# Altium project IVT_33_Shokiri_2B.PrjPcb
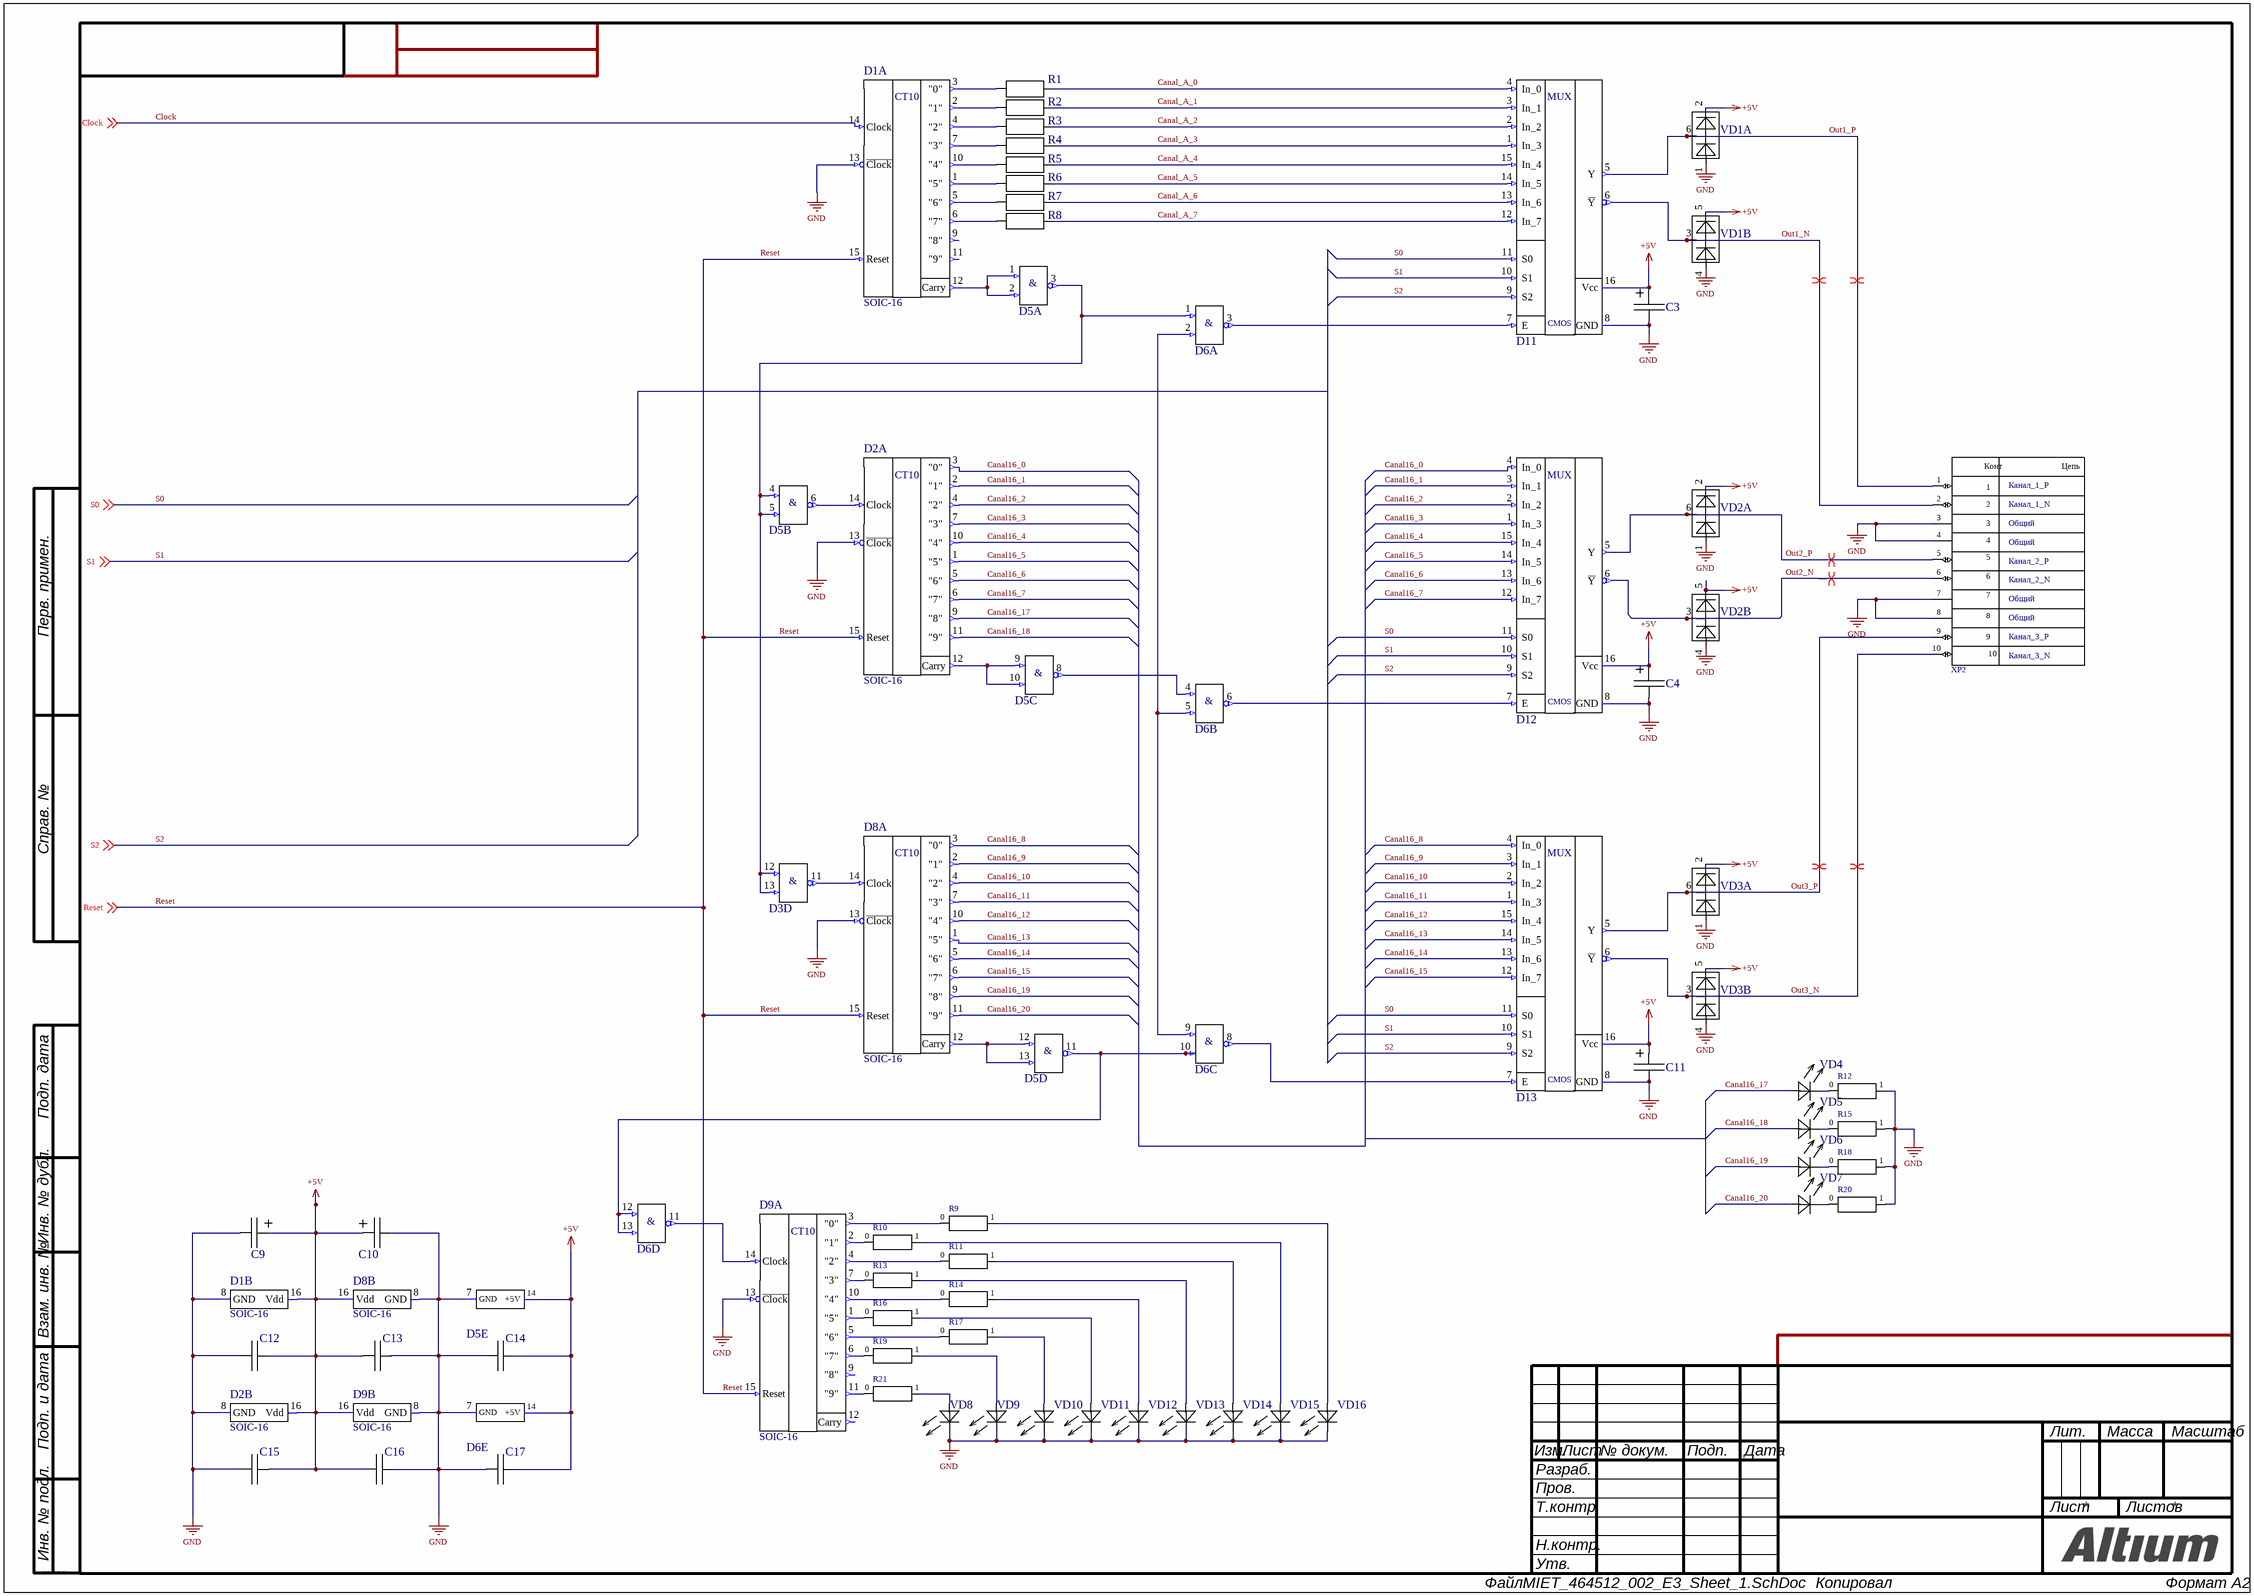
[diagram p0: MIET_464512_002_E3_Sheet_1.SchDoc]
Îáîçíà÷åíèå: ÌÈÝÒ.464512.002 Ý3; Îáîçíà÷åíèå_Êîä: ÌÈÝÒ.464512.002 Ý3; ï_Ïðîâ_Ð: Êîðíèé÷óê È.Ï.; ï_Ðàçðàá_Ð: Øîêèðè À.Ç.
2 sheets, 69 parts. Net scope: global (net labels, ports and power ports of the same name join across sheets).
Board file: MIET_464512_002_E3.PcbDoc
Sheets:
  MIET_464512_002_E3_Sheet_1.SchDoc
  MIET_464512_002_E3_Sheet_2.SchDoc

## Sheet MIET_464512_002_E3_Sheet_1.SchDoc
size 594 x 420 mm

### Parts
C3  C  [C-Tantal]  (value not drawn)
C4  C  [C-Tantal]  (value not drawn)
C9  C  [C-Tantal]  (value not drawn)
C10  C  [C-Tantal]  (value not drawn)
C11  C  [C-Tantal]  (value not drawn)
C12  (no value)  [0805_N]
C13  (no value)  [0805_N]
C14  (no value)  [0805_N]
C15  (no value)  [0805_N]
C16  (no value)  [0805_N]
C17  (no value)  [0805_N]
D1  SOIC-16  [SO16-N]  (parts A,B of 2)
D2  SOIC-16  [SO16-N]  (parts A,B of 2)
D3  74AC00PC  [DIP14]  (value not drawn)  (part D of 5)
D5  74AC00PC  [DIP14]  (value not drawn)  (parts A,B,C,D,E of 5)
D6  74AC00PC  [DIP14]  (value not drawn)  (parts A,B,C,D,E of 5)
D8  SOIC-16  [SO16-N]  (parts A,B of 2)
D9  SOIC-16  [SO16-N]  (parts A,B of 2)
D11  DIP-16  [DIP16]  (value not drawn)
D12  DIP-16  [DIP16]  (value not drawn)
D13  DIP-16  [DIP16]  (value not drawn)
R1  0805  [RES_0805_2012_N]  (value not drawn)
R2  0805  [RES_0805_2012_N]  (value not drawn)
R3  0805  [RES_0805_2012_N]  (value not drawn)
R4  0805  [RES_0805_2012_N]  (value not drawn)
R5  0805  [RES_0805_2012_N]  (value not drawn)
R6  0805  [RES_0805_2012_N]  (value not drawn)
R7  0805  [RES_0805_2012_N]  (value not drawn)
R8  0805  [RES_0805_2012_N]  (value not drawn)
R9  P1-12-0,25-5%  [RES_1206]  (value not drawn)
R10  P1-12-0,25-5%  [RES_1206]  (value not drawn)
R11  P1-12-0,25-5%  [RES_1206]  (value not drawn)
R12  P1-12-0,25-5%  [RES_1206]  (value not drawn)
R13  P1-12-0,25-5%  [RES_1206]  (value not drawn)
R14  P1-12-0,25-5%  [RES_1206]  (value not drawn)
R15  P1-12-0,25-5%  [RES_1206]  (value not drawn)
R16  P1-12-0,25-5%  [RES_1206]  (value not drawn)
R17  P1-12-0,25-5%  [RES_1206]  (value not drawn)
R18  P1-12-0,25-5%  [RES_1206]  (value not drawn)
R19  P1-12-0,25-5%  [RES_1206]  (value not drawn)
R20  P1-12-0,25-5%  [RES_1206]  (value not drawn)
R21  P1-12-0,25-5%  [RES_1206]  (value not drawn)
VD1  SOT-363  [SOT363_NXP]  (value not drawn)  (parts A,B of 2)
VD2  SOT-363  [SOT363_NXP]  (value not drawn)  (parts A,B of 2)
VD3  SOT-363  [SOT363_NXP]  (value not drawn)  (parts A,B of 2)
VD4  0805  [0805_LightDiode]  (value not drawn)
VD5  0805  [0805_LightDiode]  (value not drawn)
VD6  0805  [0805_LightDiode]  (value not drawn)
VD7  0805  [0805_LightDiode]  (value not drawn)
VD8  0805  [0805_LightDiode]  (value not drawn)
VD9  0805  [0805_LightDiode]  (value not drawn)
VD10  0805  [0805_LightDiode]  (value not drawn)
VD11  0805  [0805_LightDiode]  (value not drawn)
VD12  0805  [0805_LightDiode]  (value not drawn)
VD13  0805  [0805_LightDiode]  (value not drawn)
VD14  0805  [0805_LightDiode]  (value not drawn)
VD15  0805  [0805_LightDiode]  (value not drawn)
VD16  0805  [0805_LightDiode]  (value not drawn)
XP2  TE_1-1634688-0 "TE Connectivity"  [TE_1-1634688-0_IDC10_V]  (value not drawn)

### Nets
+5V: C3.+ C4.+ C9.+ C10.+ C11.+ C12.2 C13.1 C14.2 C15.2 C16.1 C17.2 D1.16(Vdd) D2.16(Vdd) D5.14(+5V) D6.14(+5V) D8.16(Vdd) D9.16(Vdd) D11.16(Vcc) D12.16(Vcc) D13.16(Vcc) VD1.2(K2) VD1.5(K4) VD2.2(K2) VD2.5(K4) VD3.2(K2) VD3.5(K4)
GND: C3.- C4.- C9.- C10.- C11.- C12.1 C13.2 C14.1 C15.1 C16.2 C17.1 D1.8(GND) D1.13(~{Clock}) D2.8(GND) D2.13(~{Clock}) D5.7(GND) D6.7(GND) D8.8(GND) D8.13(~{Clock}) D9.8(GND) D9.13(~{Clock}) D11.8(GND) D12.8(GND) D13.8(GND) R12.1 R15.1 R18.1 R20.1 VD1.1(A1) VD1.4(A3) VD2.1(A1) VD2.4(A3) VD3.1(A1) VD3.4(A3) VD8.K VD9.K VD10.K VD11.K VD12.K VD13.K VD14.K VD15.K VD16.K XP2.3 XP2.4 XP2.7 XP2.8
Canal16_0: D2.3("0") D12.4(In_0)
Canal16_1: D2.2("1") D12.3(In_1)
Canal16_2: D2.4("2") D12.2(In_2)
Canal16_3: D2.7("3") D12.1(In_3)
Canal16_4: D2.10("4") D12.15(In_4)
Canal16_5: D2.1("5") D12.14(In_5)
Canal16_6: D2.5("6") D12.13(In_6)
Canal16_7: D2.6("7") D12.12(In_7)
Canal16_8: D8.3("0") D13.4(In_0)
Canal16_9: D8.2("1") D13.3(In_1)
Canal16_10: D8.4("2") D13.2(In_2)
Canal16_11: D8.7("3") D13.1(In_3)
Canal16_12: D8.10("4") D13.15(In_4)
Canal16_13: D8.1("5") D13.14(In_5)
Canal16_14: D8.5("6") D13.13(In_6)
Canal16_15: D8.6("7") D13.12(In_7)
Canal16_17: D2.9("8") VD4.A
Canal16_18: D2.11("9") VD5.A
Canal16_19: D8.9("8") VD6.A
Canal16_20: D8.11("9") VD7.A
Canal_A_0: D11.4(In_0) R1.2
Canal_A_1: D11.3(In_1) R2.2
Canal_A_2: D11.2(In_2) R3.2
Canal_A_3: D11.1(In_3) R4.2
Canal_A_4: D11.15(In_4) R5.2
Canal_A_5: D11.14(In_5) R6.2
Canal_A_6: D11.13(In_6) R7.2
Canal_A_7: D11.12(In_7) R8.2
Clock: D1.14(Clock) ; off-sheet Clock
Out1_N: D11.6(~{Y}) VD1.3(K3A4) XP2.2
Out1_P: D11.5(Y) VD1.6(K1A2) XP2.1
Out2_N: D12.6(~{Y}) VD2.3(K3A4) XP2.6
Out2_P: D12.5(Y) VD2.6(K1A2) XP2.5
Out3_N: D13.6(~{Y}) VD3.3(K3A4) XP2.10
Out3_P: D13.5(Y) VD3.6(K1A2) XP2.9
Reset: D1.15(Reset) D2.15(Reset) D8.15(Reset) D9.15(Reset) ; off-sheet Reset
S0: D11.11(S0) D12.11(S0) D13.11(S0) ; off-sheet S0
S1: D11.10(S1) D12.10(S1) D13.10(S1) ; off-sheet S1
S2: D11.9(S2) D12.9(S2) D13.9(S2) ; off-sheet S2
NetD1_1: D1.1("5") R6.1
NetD1_2: D1.2("1") R2.1
NetD1_3: D1.3("0") R1.1
NetD1_4: D1.4("2") R3.1
NetD1_5: D1.5("6") R7.1
NetD1_6: D1.6("7") R8.1
NetD1_7: D1.7("3") R4.1
NetD1_10: D1.10("4") R5.1
NetD1_12: D1.12(Carry) D5.1(In1) D5.2(In2)
NetD2_12: D2.12(Carry) D5.9(In1) D5.10(In2)
NetD2_14: D2.14(Clock) D5.6(Out)
NetD3_11: D3.11(Out) D8.14(Clock)
NetD3_12: D3.12(In1) D3.13(In2) D5.3(Out) D5.4(In1) D5.5(In2) D6.1(In1)
NetD5_8: D5.8(Out) D6.4(In1)
NetD5_11: D5.11(Out) D6.10(In2) D6.12(In1) D6.13(In2)
NetD5_12: D5.12(In1) D5.13(In2) D8.12(Carry)
NetD6_2: D6.2(In2) D6.5(In2) D6.9(In1)
NetD6_3: D6.3(Out) D11.7(E)
NetD6_6: D6.6(Out) D12.7(E)
NetD6_8: D6.8(Out) D13.7(E)
NetD6_11: D6.11(Out) D9.14(Clock)
NetD9_1: D9.1("5") R16.0
NetD9_2: D9.2("1") R10.0
NetD9_3: D9.3("0") R9.0
NetD9_4: D9.4("2") R11.0
NetD9_5: D9.5("6") R17.0
NetD9_6: D9.6("7") R19.0
NetD9_7: D9.7("3") R13.0
NetD9_10: D9.10("4") R14.0
NetD9_11: D9.11("9") R21.0
NetR9_1: R9.1 VD16.A
NetR10_1: R10.1 VD15.A
NetR11_1: R11.1 VD14.A
NetR12_0: R12.0 VD4.K
NetR13_1: R13.1 VD13.A
NetR14_1: R14.1 VD12.A
NetR15_0: R15.0 VD5.K
NetR16_1: R16.1 VD11.A
NetR17_1: R17.1 VD10.A
NetR18_0: R18.0 VD6.K
NetR19_1: R19.1 VD9.A
NetR20_0: R20.0 VD7.K
NetR21_1: R21.1 VD8.A

Not connected (* = marked no-connect by the designer): D1 9("8") 11("9"); D9 9("8") 12(Carry)

### Layout directives
differential pair: Out1_N, Out1_P, Out2_N, Out2_P, Out3_N, Out3_P

### Notes on the sheet
- Канал_1_P
- Канал_1_N
- Общий
- Канал_2_P
- Канал_2_N
- Канал_3_P
- Канал_3_N
- Перв. примен.
- Справ. №
- Подп. дата
- Инв. № дубл.
- Взам. инв. №
- Подп. и дата
- Изм.
- Разраб.
- Лист
- № докум.
- Подп.
- Дата
- Лит.
- Масса
- Масштаб
- Пров.
- Т.контр.
- Листов
- Инв. № подл.
- Н.контр.
- Утв.
- ALTIUM GOSTBOM2.0 KEV
- Файл:
- Копировал
- Формат А2
- (in symbol 74AC00PC, part A) &
- (in symbol 74AC00PC, part B) &
- (in symbol 74AC00PC, part C) &
- (in symbol 74AC00PC, part D) &
- (in symbol 74HC151N) MUX; CMOS
- (in symbol HCF4017BM1, part A) CT10
- (in symbol TE_1-1634688-0 "TE Connectivity") Конт; Цепь

### Library data of the parts
C3 C4 C9-C11 = K53-65_C_10%: К53-65 Конденсатор танталовый C(6032) 0,47-100 мкФ; Manufacturer: ОАО "Элеконд"; TU: АЖЯР.673546.004 ТУ; Tolerance: 10%; Created_by: Желобаев; Name: Конденсатор К53-65; BOM: Конденсатор К53-65 "C" - *B - *мкФ ±10% АЖЯР.673546.004 ТУ; Value: *; Voltage: *; Weight: 0,3; Version: 0; Issue_date: 6.01.2019; Size: C
C12-C17 = К10-79_0805_Н90: Чип конденсатор 0805 Н90 ряд Е6; Manufacturer: ООО "Кулон"; Name: Конденсатор К10-79; Tolerance: +80%-20%; TU: АЖЯР.673511.004 ТУ; Type: K10-79; BOM: Конденсатор К10-79-*-B-*+80%-20%-Н90 АЖЯР.673511.004 ТУ; Created_by: Желобаев; Version: 0; Weight: 0.05; Voltage: *; TKE: Н90; Value: *; Value_KD: *; Case: 0805; Issue_date: 19_12_2018
D1 D2 D8 D9 = HCF4017BM1: Декадный счетчик c 10 декодированными выходами; Manufacturer: STMicroelectronics; Power_Voltage: -0.5 -22 V; BOM: Микросхема HCF4017BM1 "STMicroelectronics"; Created_by: Желобаев; Name: Микросхема HCF4017BM1; Case: SOIC-16; Issue_date: 05.04.2019; Version: 0
D3 D5 D6 = 74AC00PC: 4 элемента 2И-НЕ TTL PDIP-14; Manufacturer: ON Semiconductor; BOM: Микросхема 74AC00PC "ON Semiconductor"; Created_by: Желобаев; Power_Voltage: 4.5 - 5.5 V; Name: Микросхема 74AC00PC; Issue_date: 10.04.2019; Case: DIP-14; Version: 0
D11-D13 = 74HC151N: мультиплексор 8 канальный CMOS; Manufacturer: NXP Semiconductors; Power_Voltage: 2.0 -6.0 V; BOM: Микросхема 74HC151N "NXP Semiconductors"; Created_by: Желобаев; Name: Микросхема 74HC151N; Case: DIP-16; Issue_date: 05.04.2019; Version: 0
R1-R8 = Р1-12-0,125-5%: Резистор от 0,75 Ом до 2 МОм; Manufacturer: ОАО "НПО "Эркон"; Reliability: 0,000001; LiveStatus: Производится; Tolerance: 5%; Created_by: Желобаев; TU: АЛЯР.434110.005 ТУ; Hight: 0,5; Voltage: 150; TKR: M; Name: Резистор Р1-12-0,125; BOM: Резистор Р1-12-0,125 * 5%-M-"A" АЛЯР.434110.005 ТУ; Issue_Date: 05_12_2018; Version: 00; ComponentLink1URL: https://www.erkon-nn.ru/catalog/rezistory-obshchego-primeneniya/; ComponentLink1Description: Сайт производителя; Type: Р1-12-0,125±5%-М-"А"; Weight: 0,01; Size: 0805; Value_KD: *
R9-R21 = P1-12-0,25-5%: Резистор 270 Ом M-"A" АЛЯР.434110.005 ТУ; Manufacturer: ОАО "КБ "ИКАР""; Created_by: Сарынина; Hight: 0,5; Live_status: Дед внутри; Name: Резистор Р1-12-0,25; Reliability: 0.000001; TKR: M; Tolerance: 5%; BOM: *; Issue_Date: 23_09_2020; Size: 0805; TU: АЛЯР.434110.005 ТУ; Type: Р1-12-0,25±5%-М-"А"; Value_KD: *; Version: 00; Voltage: *; Weight: *
VD1-VD3 = BAV99S: Высокоскоростные, переключающие диоды; Manufacturer: Nexperia; BOM: Диод BAV99S "Nexperia"; Voltage: 100; Name: Диод BAV99S; Created_by: Желобаев; Version: 0; Case: SOT-363; Issue_date: 07.01.2019
VD4-VD7 VD9-VD16 = AP2012MGC: светодиод 0805 зеленый; Manufacturer: Kingbright; BOM: Диод AP2012MGC  "Kingbright"; Name: Диод AP2012MGC; Created_by: Желобаев; Version: 0; Case: 0805; Issue_date: 13.05.2019
VD8 = AP2012EC: светодиод 0805 красный; Manufacturer: Kingbright; BOM: Диод AP2012EC  "Kingbright"; Name: Диод AP2012EC; Created_by: Желобаев; Version: 0; Case: 0805; Issue_date: 13.05.2019
XP2 = TE_1-1634688-0 "TE Connectivity": Вилка прямая

## Sheet MIET_464512_002_E3_Sheet_2.SchDoc
size A2
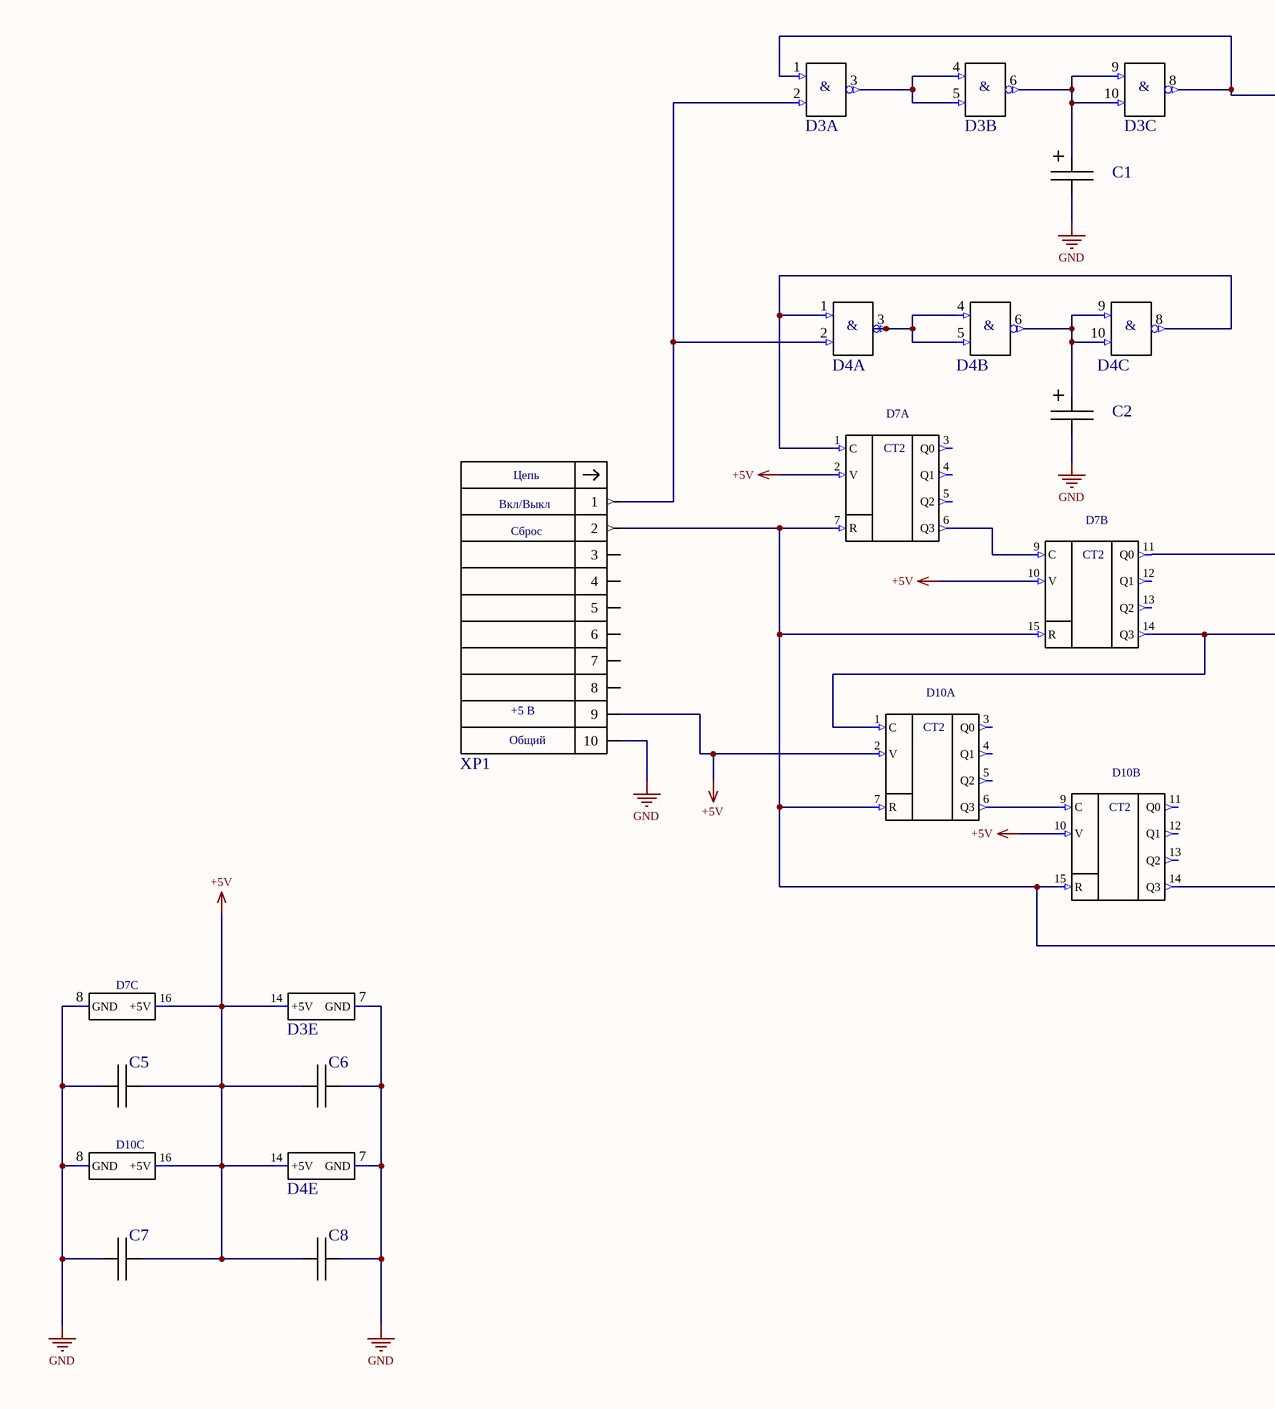
[diagram p1: MIET_464512_002_E3_Sheet_2.SchDoc, left]
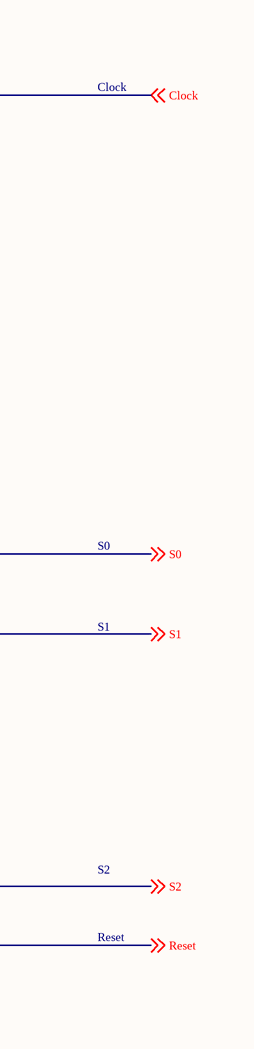
[diagram p2: MIET_464512_002_E3_Sheet_2.SchDoc, right]

### Parts
C1  C  [C-Tantal]  (value not drawn)
C2  C  [C-Tantal]  (value not drawn)
C5  (no value)  [0805_N]
C6  (no value)  [0805_N]
C7  (no value)  [0805_N]
C8  (no value)  [0805_N]
D3  74AC00PC  [DIP14]  (value not drawn)  (parts A,B,C,E of 5)
D4  74AC00PC  [DIP14]  (value not drawn)  (parts A,B,C,E of 5)
D7  MC14520BCP  [DIP16]  (value not drawn)  (parts A,B,C of 3)
D10  MC14520BCP  [DIP16]  (value not drawn)  (parts A,B,C of 3)
XP1  TE_1-1634689-0  [BH-10R]  (value not drawn)

### Nets
+5V: C5.2 C6.1 C7.2 C8.1 D3.14(+5V) D4.14(+5V) D7.2(V) D7.10(V) D7.16(+5V) D10.2(V) D10.10(V) D10.16(+5V) XP1.9
GND: C1.- C2.- C5.1 C6.2 C7.1 C8.2 D3.7(GND) D4.7(GND) D7.8(GND) D10.8(GND) XP1.10
Clock: D3.1(In1) D3.8(Out) ; off-sheet Clock
Reset: D7.7(R) D7.15(R) D10.7(R) D10.15(R) XP1.2 ; off-sheet Reset
S0: D7.11(Q0) ; off-sheet S0
S1: D7.14(Q3) D10.1(C) ; off-sheet S1
S2: D10.14(Q3) ; off-sheet S2
NetC1_+: C1.+ D3.6(Out) D3.9(In1) D3.10(In2)
NetC2_+: C2.+ D4.6(Out) D4.9(In1) D4.10(In2)
NetD3_2: D3.2(In2) D4.2(In2) XP1.1
NetD3_3: D3.3(Out) D3.4(In1) D3.5(In2)
NetD4_1: D4.1(In1) D4.8(Out) D7.1(C)
NetD4_3: D4.3(Out) D4.4(In1) D4.5(In2)
NetD7_6: D7.6(Q3) D7.9(C)
NetD10_6: D10.6(Q3) D10.9(C)

Not connected (* = marked no-connect by the designer): D7 3(Q0) 4(Q1) 5(Q2) 12(Q1) 13(Q2); D10 3(Q0) 4(Q1) 5(Q2) 11(Q0) 12(Q1) 13(Q2); XP1 3 4 5 6 7 8

### Notes on the sheet
- Clock
- Вкл/Выкл
- Сброс
- S0
- S1
- Общий
- +5 В
- S2
- Reset
- Title
- Size:
- Date:
- File:
- A2
- Number:
- Time:
- Revision:
- Sheet
- of
- (in symbol 74AC00PC, part A) &
- (in symbol 74AC00PC, part B) &
- (in symbol 74AC00PC, part C) &
- (in symbol MC14520BCP, part A) CT2
- (in symbol MC14520BCP, part B) CT2
- (in symbol TE_1-1634689-0) Цепь

### Library data of the parts
C1 C2 = K53-65_C_10%: as C3 on sheet MIET_464512_002_E3_Sheet_1; Value: *; Voltage: *; Weight: 0,3; Version: 0; Issue_date: 6.01.2019; Size: C
C5-C8 = К10-79_0805_Н90: as C12 on sheet MIET_464512_002_E3_Sheet_1; Version: 0; Weight: 0.05; Voltage: *; TKE: Н90; Value: *; Value_KD: *; Case: 0805; Issue_date: 19_12_2018
D3 D4 = 74AC00PC: as D3 on sheet MIET_464512_002_E3_Sheet_1; Issue_date: 10.04.2019; Case: DIP-14; Version: 0
D7 D10 = MC14520BCP: Два двоичных счетчика; Manufacturer: Motorola; Created_by: Желобаев; Name: Микросхема MC14520BCP; BOM: Микросхема MC14520BCP "Motorola"; Issue_date: 6.01.2019; Version: 0; Case: DIP-16
XP1 = TE_1-1634689-0: Вилка типа BH-10R угловая правая двухрядная 2х5х2.54; Manufacturer: TE Connectivity; Created_by: Желобаев; BOM: Вилка угловая TE_1-1634689-0 "TE Connectivity"; Name: Вилка угловая TE_1-1634689-0; Issue_date: 13.05.2019; Version: 0; Case: BH-10R

## Nets that join several sheets
+5V: MIET_464512_002_E3_Sheet_1 (26 pins), MIET_464512_002_E3_Sheet_2 (13 pins)
GND: MIET_464512_002_E3_Sheet_1 (47 pins), MIET_464512_002_E3_Sheet_2 (11 pins)
Clock: MIET_464512_002_E3_Sheet_1 (D1.14), MIET_464512_002_E3_Sheet_2 (D3.1 D3.8)
Reset: MIET_464512_002_E3_Sheet_1 (D1.15 D2.15 D8.15 D9.15), MIET_464512_002_E3_Sheet_2 (5 pins)
S0: MIET_464512_002_E3_Sheet_1 (D11.11 D12.11 D13.11), MIET_464512_002_E3_Sheet_2 (D7.11)
S1: MIET_464512_002_E3_Sheet_1 (D11.10 D12.10 D13.10), MIET_464512_002_E3_Sheet_2 (D7.14 D10.1)
S2: MIET_464512_002_E3_Sheet_1 (D11.9 D12.9 D13.9), MIET_464512_002_E3_Sheet_2 (D10.14)